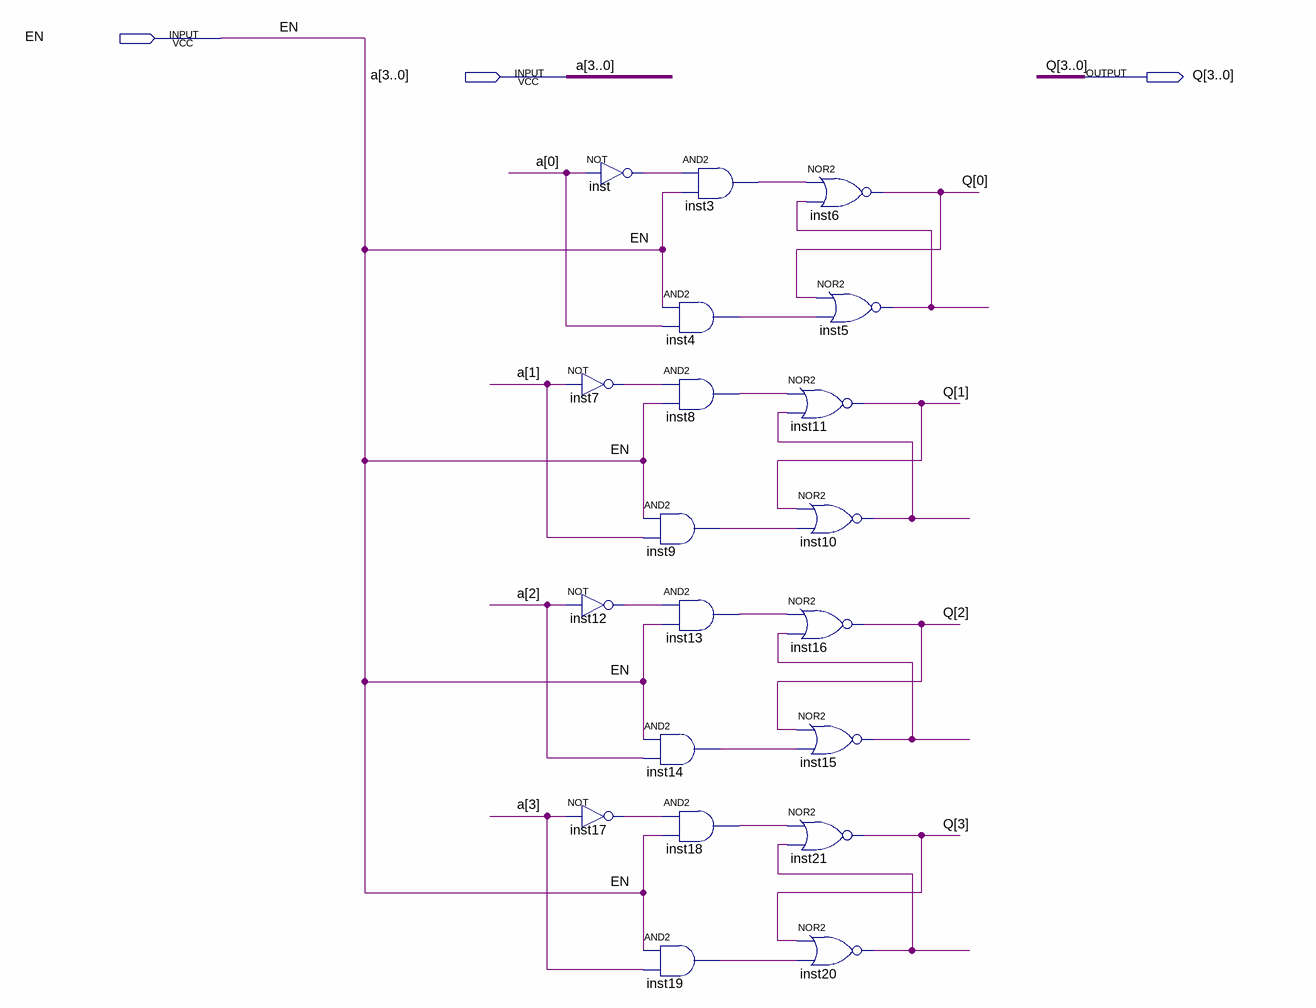
[diagram p0: schematic sheet]
// Quartus schematic 4bitregisterrw.bdf as structural Verilog: 20 symbols, 3 pins
module \4bitregisterrw  (
  input  EN,
  input  [3:0] a,
  output [3:0] Q
);

  wire inst3_out, inst4_out, inst5_out, inst7_out, inst8_out, inst9_out, inst10_out, inst12_out, inst13_out,
       inst14_out, inst15_out, inst17_out, inst18_out, inst19_out, inst20_out, inst_out;

  not inst (inst_out, a[0]);
  not inst7 (inst7_out, a[1]);
  not inst12 (inst12_out, a[2]);
  not inst17 (inst17_out, a[3]);
  and inst3 (inst3_out, inst_out, EN);
  and inst4 (inst4_out, EN, a[0]);
  and inst8 (inst8_out, inst7_out, EN);
  and inst9 (inst9_out, EN, a[1]);
  and inst13 (inst13_out, inst12_out, EN);
  and inst14 (inst14_out, EN, a[2]);
  and inst18 (inst18_out, inst17_out, EN);
  and inst19 (inst19_out, EN, a[3]);
  nor inst6 (Q[0], inst3_out, inst5_out);
  nor inst5 (inst5_out, Q[0], inst4_out);
  nor inst11 (Q[1], inst8_out, inst10_out);
  nor inst10 (inst10_out, Q[1], inst9_out);
  nor inst16 (Q[2], inst13_out, inst15_out);
  nor inst15 (inst15_out, Q[2], inst14_out);
  nor inst21 (Q[3], inst18_out, inst20_out);
  nor inst20 (inst20_out, Q[3], inst19_out);
endmodule
